# Altium schematic sheet ui_IO.SchDoc
size A4
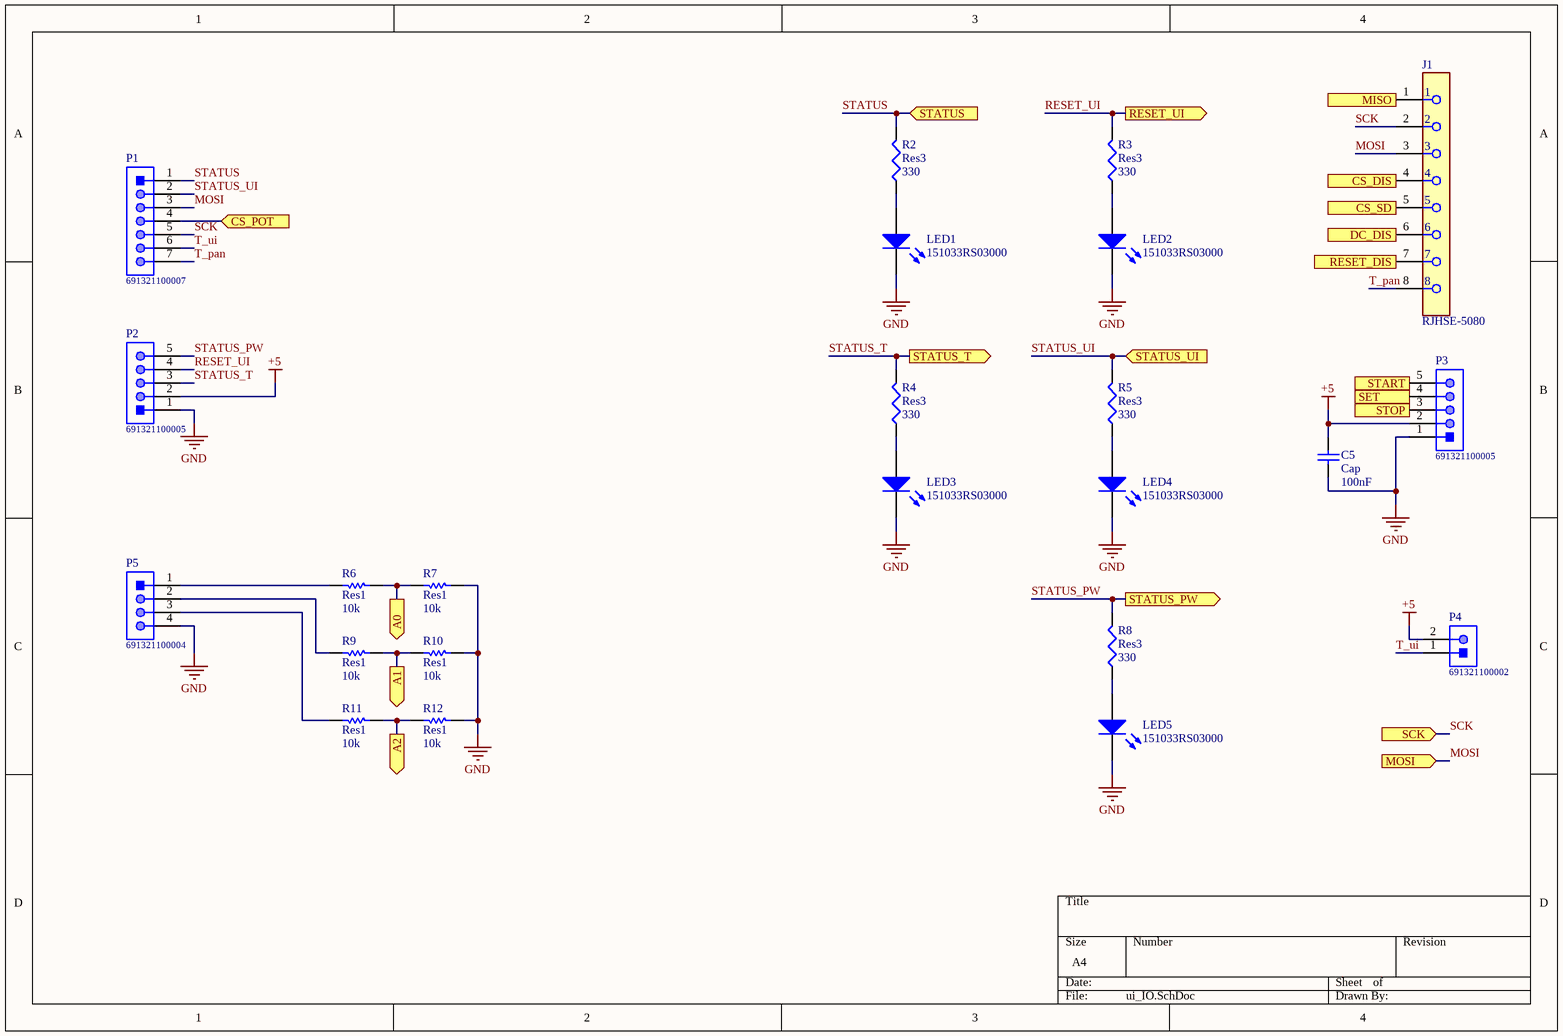
[diagram p0: ui_IO.SchDoc]

## Parts
C5  Cap  value 100nF  [RAD-0.3]
J1  RJHSE-5080  [FP-RJHSE-5080-MFG]
LED1  151033RS03000  [Type 3mm]
LED2  151033RS03000  [Type 3mm]
LED3  151033RS03000  [Type 3mm]
LED4  151033RS03000  [Type 3mm]
LED5  151033RS03000  [Type 3mm]
P1  691321100007  [691321100007]
P2  691321100005  [691321100005]
P3  691321100005  [691321100005]
P4  691321100002  [691321100002]
P5  691321100004  [691321100004]
R2  Res3  value 330  [AXIAL-0.4]
R3  Res3  value 330  [AXIAL-0.4]
R4  Res3  value 330  [AXIAL-0.4]
R5  Res3  value 330  [AXIAL-0.4]
R6  Res1  value 10k  [AXIAL-0.4]
R7  Res1  value 10k  [AXIAL-0.4]
R8  Res3  value 330  [AXIAL-0.4]
R9  Res1  value 10k  [AXIAL-0.4]
R10  Res1  value 10k  [AXIAL-0.4]
R11  Res1  value 10k  [AXIAL-0.4]
R12  Res1  value 10k  [AXIAL-0.4]

## Ports
A0 (out), A1 (out), A2 (out), CS_DIS (in), CS_POT (in), CS_SD (in), DC_DIS (in), MISO (out), MOSI (in), RESET_DIS (in), RESET_UI (out), SCK (in), SET (in), START (in), STATUS (in), STATUS_PW (out), STATUS_T (out), STATUS_UI (in), STOP (in)

## Nets
+5: C5.2 P2.2 P3.2 P4.2
GND: C5.1 LED1.1(K) LED2.1(K) LED3.1(K) LED4.1(K) LED5.1(K) P2.1 P3.1 P5.4 R7.1 R10.1 R12.1
A0: R6.1 R7.2 ; port A0
A1: R9.1 R10.2 ; port A1
A2: R11.1 R12.2 ; port A2
CS_DIS: J1.4 ; port CS_DIS
CS_POT: P1.4 ; port CS_POT
CS_SD: J1.5 ; port CS_SD
DC_DIS: J1.6 ; port DC_DIS
MISO: J1.1 ; port MISO
MOSI: J1.3 P1.3 ; port MOSI
RESET_DIS: J1.7 ; port RESET_DIS
RESET_UI: P2.4 R3.2 ; port RESET_UI
SCK: J1.2 P1.5 ; port SCK
SET: P3.4 ; port SET
START: P3.5 ; port START
STATUS: P1.1 R2.2 ; port STATUS
STATUS_PW: P2.5 R8.2 ; port STATUS_PW
STATUS_T: P2.3 R4.2 ; port STATUS_T
STATUS_UI: P1.2 R5.2 ; port STATUS_UI
STOP: P3.3 ; port STOP
T_pan: J1.8 P1.7
T_ui: P1.6 P4.1
NetLED1_2: LED1.2(A) R2.1
NetLED2_2: LED2.2(A) R3.1
NetLED3_2: LED3.2(A) R4.1
NetLED4_2: LED4.2(A) R5.1
NetLED5_2: LED5.2(A) R8.1
NetP5_1: P5.1 R6.2
NetP5_2: P5.2 R9.2
NetP5_3: P5.3 R11.2

## Library data of the parts
C5 = Cap: Capacitor; Published: 8-Jun-2000; LatestRevisionDate: 17-Jul-2002; LatestRevisionNote: Re-released for DXP Platform.; PackageReference: RAD-0.3; Publisher: Altium Limited; PackageDescription: Radial Cap, Thru-Hole; 2 Leads; 0.3 in Pin Spacing
J1 = CMP-02366-000003-1: CONN MOD JACK 8P8C R/A UNSHLD; Manufacturer: Amphenol; Current Rating: 1.5A; Voltage Rating: 125V; Pitch: 1.02mm; Conn Orientation: Right Angle; Number Of Contacts: 8; Is Female: yes; Conn Gender: Female; Lead Free: Yes; Device Class L3: unset; Footprint Url: https://cdn.amphenol-icc.com/media/wysiwyg/files/drawing/rjhse5080.pdf?__cf_chl_jschl_tk__=e349db0bbbb6188a39347cd5e541b92fa02c9719-1587748343-0-AW7tChdeHzRPLX9gSWj7WrKaXQoY9BsmT9Ek0h-T62M9y3Rs9iypFcOtkzb-6sGYQEjFE-jcoNciDETCOZrh1rYyOesac5SvYLoLwHIsHvF4AKBlx-MXmfZUVk9OTTJLqyQq2qMm0PFRLJpNcK0nrKResqOniRSYixG2sPTmOPraH-ULJFBDL602CHqcI9KKBgTq90Jh1OL2Td4moJ99rFsJRJ1Tk_uoxGe8ublcP_ARu-uLpWcQrBcwOcHDTAwL29DAwVaqcH7ta8Ks7WMlHmVl_pILeEDwT0bE9vu5Pa5S3PtNRF1leuFkgi_FMbUxTDulc5xzbXSfng8srUIV1lWXny5nx1fZJEUa_w97yKjffzBMxiWLWVN-V7-uqAaPbyv_m-wRyw5O25OZNyJOeGU; ComponentLink2URL: https://cdn.amphenol-icc.com/media/wysiwyg/files/documentation/datasheet/inputoutput/io-modjack-rjhse.pdf; Device Class L1: Connectors; Package: CONN_MOD_JACK; Mouser Description: Modular Connectors / Ethernet Connectors R/A RJ45 NONSHIELDED 8 CONT NO LEDS; Manufacturer Part Number: RJHSE-5080; Octopart: https://octopart.com/rjhse-5080-amphenol-45060; Category: Conn; Height: 0.535inch; Temperature: -55°C to +85°C; Digikey Description: CONN MOD JACK 8P8C R/A UNSHLD; Device Class L2: Modular / Ethernet Connectors; Contact Material: Gold,Nickel; ComponentLink2Description: Datasheet; Temperature Range Low: -55°C; RoHS: TRUE; Automotive: No; Temperature Range High: +85°C
LED1-LED5 = CMP-1489-00004-1: THT LED round mono-color waterclear, WL-TMRW, Red; Manufacturer: Wuerth Elektronik; ComponentLink1URL: http://www.we-online.com; PartNumber: 151033RS03000; ComponentLink1Description: Manufacturer URL; PackageReference: Type 3mm; ComponentLink2Description: Datasheet; Emitting color: Red; ComponentLink2URL: http://katalog.we-online.de/pbs/datasheet/7448042001.pdfhttp://katalog.we-online.de/pbs/datasheet/7448042001.pdfhttp://katalog.we-online.de/pbs/datasheet/7448042001.pdfhttp://katalog.we-online.de/pbs/datasheet/151033RS03000.pdf
P1 = CMP-1502-01788-1: Serie 3211 - 3.50mm Vertical PCB Header WR-TBL, 7 pin; Manufacturer: Wurth Elektronik; Gender: Male; Pin Number: 7; Manufacturer URL: http://www.we-online.de; Package Reference: 691321100007; Part Number: 691321100007; Packaging: Box; Publisher: WurthElektronik; Operating Temperature: -40to105degC; Pitch: 3.50mm; Mounting Technology: THT; Datasheet URL: http://katalog.we-online.de/em/datasheet/6913211000xx.pdf
P2 P3 = CMP-1502-01786-1: Serie 3211 - 3.50mm Vertical PCB Header WR-TBL, 5 pin; Manufacturer: Wurth Elektronik; Pin Number: 5; Gender: Male; Datasheet URL: http://katalog.we-online.de/em/datasheet/6913211000xx.pdf; Package Reference: 691321100005; Manufacturer URL: http://www.we-online.de; Pitch: 3.50mm; Operating Temperature: -40to105degC; Publisher: WurthElektronik; Packaging: Box; Part Number: 691321100005; Mounting Technology: THT
P4 = CMP-1502-01783-1: Serie 3211 - 3.50mm Vertical PCB Header WR-TBL, 2 pin; Manufacturer: Wurth Elektronik; Gender: Male; Pin Number: 2; Part Number: 691321100002; Mounting Technology: THT; Manufacturer URL: http://www.we-online.de; Datasheet URL: http://katalog.we-online.de/em/datasheet/6913211000xx.pdf; Packaging: Box; Package Reference: 691321100002; Publisher: WurthElektronik; Pitch: 3.50mm; Operating Temperature: -40to105degC
P5 = CMP-1502-01785-1: Serie 3211 - 3.50mm Vertical PCB Header WR-TBL, 4 pin; Manufacturer: Wurth Elektronik; Gender: Male; Pin Number: 4; Operating Temperature: -40to105degC; Packaging: Box; Package Reference: 691321100004; Part Number: 691321100004; Mounting Technology: THT; Pitch: 3.50mm; Publisher: WurthElektronik; Manufacturer URL: http://www.we-online.de; Datasheet URL: http://katalog.we-online.de/em/datasheet/6913211000xx.pdf
R2-R5 R8 = Res3: Resistor; Published: 8-Jun-2000; LatestRevisionDate: 29-May-2009; LatestRevisionNote: IPC-7351 Footprint Added.; PackageReference: J1-0603; Publisher: Altium Limited; PackageDescription: Chip Resistor
R6 R7 R9-R12 = Res1: Resistor; Published: 8-Jun-2000; LatestRevisionDate: 17-Jul-2002; LatestRevisionNote: Re-released for DXP Platform.; PackageReference: AXIAL-0.3; Publisher: Altium Limited; PackageDescription: Axial Device, Thru-Hole; 2 Leads; 0.3 in Pin Spacing